# Altium schematic sheet Relay.SchDoc
size A; SheetNumber: 3; SheetTotal: 4
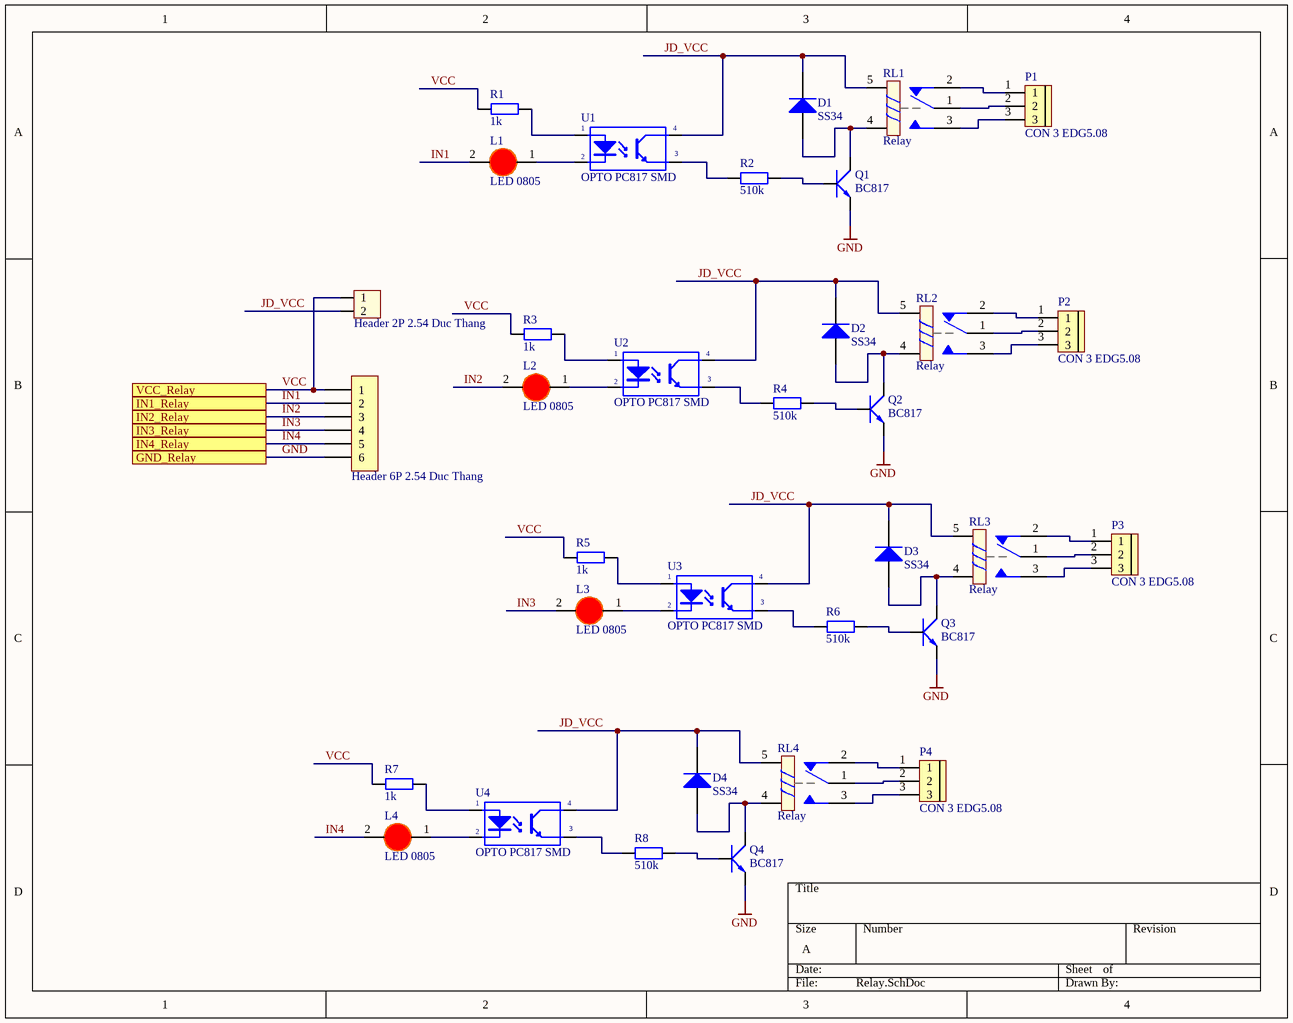
[diagram p0: Relay.SchDoc]

## Parts
D1  SS34  [DIODE SMA]
D2  SS34  [DIODE SMA]
D3  SS34  [DIODE SMA]
D4  SS34  [DIODE SMA]
H1  Header 2P 2.54 Duc Thang  [XH2.54M-2]
H2  Header 6P 2.54 Duc Thang  [XH2.54M-6]
L1  LED 0805  [LED-0805-Red]
L2  LED 0805  [LED-0805-Red]
L3  LED 0805  [LED-0805-Red]
L4  LED 0805  [LED-0805-Red]
P1  CON 3 EDG5.08  [CON 3 3EDG5.08]
P2  CON 3 EDG5.08  [CON 3 3EDG5.08]
P3  CON 3 EDG5.08  [CON 3 3EDG5.08]
P4  CON 3 EDG5.08  [CON 3 3EDG5.08]
Q1  BC817  [SOT-23]
Q2  BC817  [SOT-23]
Q3  BC817  [SOT-23]
Q4  BC817  [SOT-23]
R1  1k  [tro smd 0805]
R2  510k  [tro smd 0805]
R3  1k  [tro smd 0805]
R4  510k  [tro smd 0805]
R5  1k  [tro smd 0805]
R6  510k  [tro smd 0805]
R7  1k  [tro smd 0805]
R8  510k  [tro smd 0805]
RL1  Relay  [Relay 5 Chan SRD]
RL2  Relay  [Relay 5 Chan SRD]
RL3  Relay  [Relay 5 Chan SRD]
RL4  Relay  [Relay 5 Chan SRD]
U1  OPTO PC817 SMD  [SOP4]
U2  OPTO PC817 SMD  [SOP4]
U3  OPTO PC817 SMD  [SOP4]
U4  OPTO PC817 SMD  [SOP4]

## Ports
GND_Relay, IN1_Relay, IN2_Relay, IN3_Relay, IN4_Relay, VCC_Relay

## Nets
GND: H2.6 Q1.2(E) Q2.2(E) Q3.2(E) Q4.2(E) ; port GND_Relay
IN1: H2.2 L1.2(K) ; port IN1_Relay
IN2: H2.3 L2.2(K) ; port IN2_Relay
IN3: H2.4 L3.2(K) ; port IN3_Relay
IN4: H2.5 L4.2(K) ; port IN4_Relay
JD_VCC: D1.2(K) D2.2(K) D3.2(K) D4.2(K) H1.2 RL1.5 RL2.5 RL3.5 RL4.5 U1.4(C) U2.4(C) U3.4(C) U4.4(C)
VCC: H1.1 H2.1 R1.2 R3.2 R5.2 R7.2 ; port VCC_Relay
NetD1_1: D1.1(A) Q1.3(C) RL1.4
NetD2_1: D2.1(A) Q2.3(C) RL2.4
NetD3_1: D3.1(A) Q3.3(C) RL3.4
NetD4_1: D4.1(A) Q4.3(C) RL4.4
NetL1_1: L1.1(A) U1.2(K)
NetL2_1: L2.1(A) U2.2(K)
NetL3_1: L3.1(A) U3.2(K)
NetL4_1: L4.1(A) U4.2(K)
NetP1_1: P1.1 RL1.2
NetP1_2: P1.2 RL1.1
NetP1_3: P1.3 RL1.3
NetP2_1: P2.1 RL2.2
NetP2_2: P2.2 RL2.1
NetP2_3: P2.3 RL2.3
NetP3_1: P3.1 RL3.2
NetP3_2: P3.2 RL3.1
NetP3_3: P3.3 RL3.3
NetP4_1: P4.1 RL4.2
NetP4_2: P4.2 RL4.1
NetP4_3: P4.3 RL4.3
NetQ1_1: Q1.1(B) R2.2
NetQ2_1: Q2.1(B) R4.2
NetQ3_1: Q3.1(B) R6.2
NetQ4_1: Q4.1(B) R8.2
NetR1_1: R1.1 U1.1(A)
NetR2_1: R2.1 U1.3(E)
NetR3_1: R3.1 U2.1(A)
NetR4_1: R4.1 U2.3(E)
NetR5_1: R5.1 U3.1(A)
NetR6_1: R6.1 U3.3(E)
NetR7_1: R7.1 U4.1(A)
NetR8_1: R8.1 U4.3(E)

## Library data of the parts
D1-D4 = Diode SS34 ( 1N5822 ): Dán; Don_Vi: Con; Ma_Hang: MH002104; Ten_Linh_Kien: Diode SS34 3A 40V SMA ( 1N5822 SS34A); Kieu_Chan: *; Chung_Loai: Dán
H1 = Header 2P 2.54 Duc Thang: Cắm; Ten_Linh_Kien: Header 2P XH2.54-2P Đực Thẳng; Don_Vi: Con; Ma_Hang: MH001283; Chung_Loai: Cắm
H2 = Header 6P 2.54 Duc Thang: Cắm; Ten_Linh_Kien: Header 6P XH2.54-6P Đực Thẳng; Don_Vi: Con; Ma_Hang: MH001972; Chung_Loai: Cắm
L1-L4 = LED 0805 Do: Dán; Don_Vi: Con; Ma_Hang: MH000897; Ten_Linh_Kien: LED 0805 Màu Đỏ (Red); Ghi_Chu: *; Kieu_Chan: *; Chung_Loai: Dán
P1-P4 = CON 3 EDG5.08: Cắm; Ten_Linh_Kien: CON 3 2EDG5.08-3P 5.08MM ( Xanh Cong); Ma_Hang: MH000760; Ghi_Chu: *; Kieu_Chan: *; Don_Vi: Con; Chung_Loai: Cắm
Q1-Q4 = Trans BC817: SOT-23 - C8658; Value: C9014
R1 R3 R5 R7 = Tro 0805 1% 1k: Dán; Don_Vi: Con; So_Chan: 2; Ten_Linh_Kien: Trở 0805 1% 1k; Ma_Hang: MH005468; Chung_Loai: Dán; Kieu_Chan: *
R2 R4 R6 R8 = Tro 0805 1% 510k: Dán; Don_Vi: Con; So_Chan: 2; Ten_Linh_Kien: Trở 0805 1% 510k; Ma_Hang: MH005486; Chung_Loai: Dán; Kieu_Chan: *
RL1-RL4 = Relay 5 Chan SRD: Relay 5 Chan; Ma_Hang: MH009374; Ten: Relay 5V10A SRD-05VDC-SL-C Chính Hãng
U1-U4 = OPTO PC817 SMD: Single Opto; Value: PC817